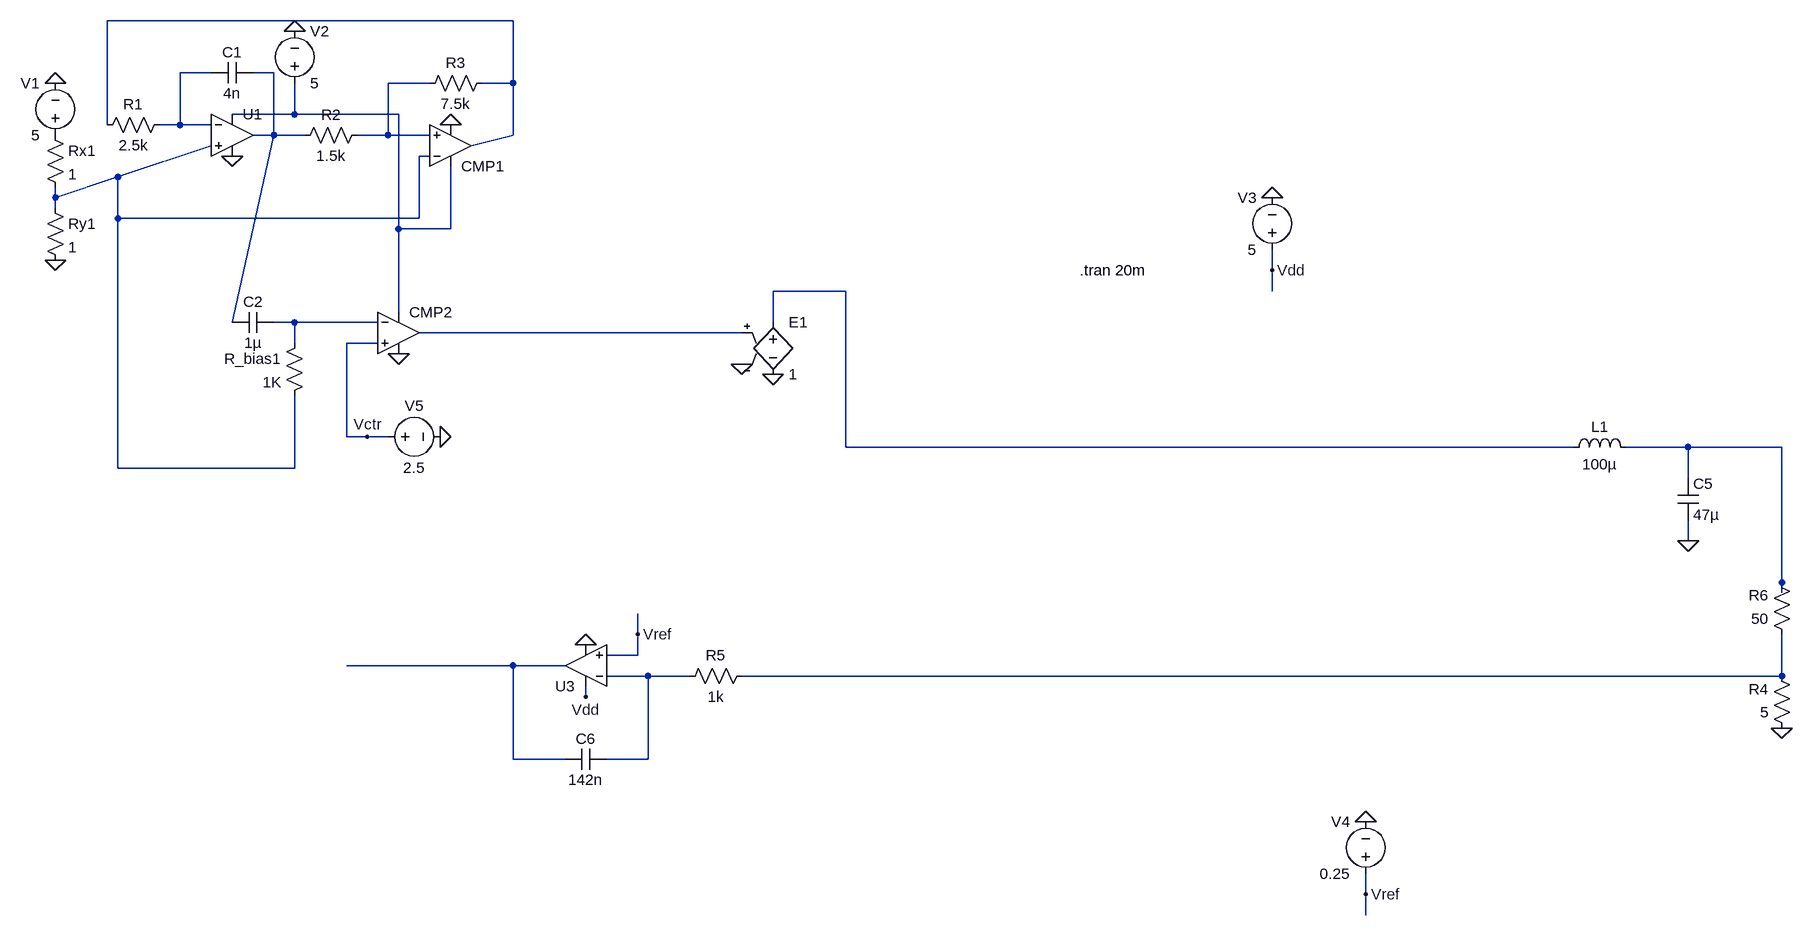
[diagram p0: schematic Module_3 copy.asc]
Module_3 copy.asc, the LTspice schematic file:
Version 4
SHEET 1 1484 1276
WIRE -640 -128 -1264 -128
WIRE -1104 -48 -1152 -48
WIRE -1008 -48 -1040 -48
WIRE -768 -32 -832 -32
WIRE -640 -32 -640 -128
WIRE -640 -32 -688 -32
WIRE -976 16 -976 -32
WIRE -976 16 -1072 16
WIRE -816 16 -976 16
WIRE -1264 32 -1264 -128
WIRE -1152 32 -1152 -48
WIRE -1152 32 -1184 32
WIRE -1104 32 -1152 32
WIRE -1008 48 -1008 -48
WIRE -1008 48 -1040 48
WIRE -960 48 -1008 48
WIRE -832 48 -832 -32
WIRE -832 48 -880 48
WIRE -768 48 -832 48
WIRE -640 48 -640 -32
WIRE -704 64 -640 48
WIRE -768 80 -784 80
WIRE -1248 112 -1104 64
WIRE -1344 144 -1248 112
WIRE -1344 144 -1344 128
WIRE -1344 160 -1344 144
WIRE -1248 176 -1248 112
WIRE -784 176 -784 80
WIRE -784 176 -1248 176
WIRE -816 192 -816 16
WIRE -736 192 -736 96
WIRE -736 192 -816 192
WIRE 528 256 528 224
WIRE -128 288 -240 288
WIRE 528 288 528 256
WIRE -816 320 -816 192
WIRE -1072 336 -1008 48
WIRE -976 336 -1008 336
WIRE -848 336 -976 336
WIRE -240 336 -240 288
WIRE -288 352 -784 352
WIRE -976 368 -976 336
WIRE -848 368 -896 368
WIRE -896 512 -896 368
WIRE -864 512 -896 512
WIRE -832 512 -864 512
WIRE -128 528 -128 288
WIRE 992 528 -128 528
WIRE 1168 528 1072 528
WIRE 1312 528 1168 528
WIRE -1248 560 -1248 176
WIRE -976 560 -976 448
WIRE -976 560 -1248 560
WIRE 1168 576 1168 528
WIRE 1168 672 1168 640
WIRE 1312 736 1312 528
WIRE 1312 752 1312 736
WIRE -448 816 -448 784
WIRE -448 848 -448 816
WIRE -448 848 -496 848
WIRE -640 864 -896 864
WIRE -560 864 -640 864
WIRE -432 880 -496 880
WIRE -368 880 -432 880
WIRE 1312 880 1312 816
WIRE 1312 880 -288 880
WIRE -528 912 -528 896
WIRE -640 1008 -640 864
WIRE -560 1008 -640 1008
WIRE -432 1008 -432 880
WIRE -432 1008 -496 1008
WIRE 672 1216 672 1184
WIRE 672 1248 672 1216
FLAG -1344 -32 0
FLAG -1344 240 0
FLAG -976 -112 0
FLAG -1072 80 0
FLAG -816 384 0
FLAG -736 32 0
FLAG 1168 672 0
FLAG 528 144 0
FLAG 528 256 Vdd
FLAG -528 912 Vdd
FLAG 1312 960 0
FLAG -528 832 0
FLAG 672 1104 0
FLAG 672 1216 Vref
FLAG -448 816 Vref
FLAG -752 512 0
FLAG -864 512 Vctr
FLAG -288 400 0
FLAG -240 416 0
SYMBOL voltage -1344 64 R180
WINDOW 0 24 96 Left 2
WINDOW 3 24 16 Left 2
SYMATTR InstName V1
SYMATTR Value 5
SYMBOL res -1360 32 R0
SYMATTR InstName Rx1
SYMATTR Value 1
SYMBOL res -1360 144 R0
SYMATTR InstName Ry1
SYMATTR Value 1
SYMBOL res -1168 16 R90
WINDOW 0 0 56 VBottom 2
WINDOW 3 32 56 VTop 2
SYMATTR InstName R1
SYMATTR Value 2.5k
SYMBOL res -864 32 R90
WINDOW 0 0 56 VBottom 2
WINDOW 3 32 56 VTop 2
SYMATTR InstName R2
SYMATTR Value 1.5k
SYMBOL res -672 -48 R90
WINDOW 0 0 56 VBottom 2
WINDOW 3 32 56 VTop 2
SYMATTR InstName R3
SYMATTR Value 7.5k
SYMBOL cap -1104 -32 R270
WINDOW 0 32 32 VTop 2
WINDOW 3 0 32 VBottom 2
SYMATTR InstName C1
SYMATTR Value 4n
SYMBOL cap -1008 320 R90
WINDOW 0 0 32 VBottom 2
WINDOW 3 32 32 VTop 2
SYMATTR InstName C2
SYMATTR Value 1µ
SYMBOL voltage -976 -16 M180
WINDOW 0 24 96 Left 2
WINDOW 3 24 16 Left 2
SYMATTR InstName V2
SYMATTR Value 5
SYMBOL res -960 352 M0
SYMATTR InstName R_bias1
SYMATTR Value 1K
SYMBOL UniversalOpamp2 -736 64 M180
SYMATTR InstName CMP1
SYMBOL UniversalOpamp2 -816 352 R0
SYMATTR InstName CMP2
SYMBOL UniversalOpamp2 -1072 48 R0
SYMATTR InstName U1
SYMBOL cap 1152 576 R0
SYMATTR InstName C5
SYMATTR Value 47µ
SYMBOL ind 976 544 R270
WINDOW 0 32 56 VTop 2
WINDOW 3 5 56 VBottom 2
SYMATTR InstName L1
SYMATTR Value 100µ
SYMBOL voltage 528 240 R180
WINDOW 0 24 96 Left 2
WINDOW 3 24 16 Left 2
SYMATTR InstName V3
SYMATTR Value 5
SYMBOL UniversalOpamp2 -528 864 R180
SYMATTR InstName U3
SYMBOL res -272 864 R90
WINDOW 0 0 56 VBottom 2
WINDOW 3 32 56 VTop 2
SYMATTR InstName R5
SYMATTR Value 1k
SYMBOL cap -496 992 R90
WINDOW 0 0 32 VBottom 2
WINDOW 3 32 32 VTop 2
SYMATTR InstName C6
SYMATTR Value 142n
SYMBOL res 1328 976 R180
WINDOW 0 36 76 Left 2
WINDOW 3 36 40 Left 2
SYMATTR InstName R4
SYMATTR Value 5
SYMBOL voltage 672 1200 R180
WINDOW 0 24 96 Left 2
WINDOW 3 24 16 Left 2
SYMATTR InstName V4
SYMATTR Value 0.25
SYMBOL res 1328 832 R180
WINDOW 0 36 76 Left 2
WINDOW 3 36 40 Left 2
SYMATTR InstName R6
SYMATTR Value 50
SYMBOL voltage -848 512 R270
WINDOW 0 32 56 VTop 2
WINDOW 3 -32 56 VBottom 2
SYMATTR InstName V5
SYMATTR Value 2.5
SYMBOL e -240 320 R0
SYMATTR InstName E1
SYMATTR Value 1
TEXT 232 256 Left 2 !.tran 20m

The netlist it stands for:
* Module_3 copy.asc
V1 P001 0 5
Rx1 P001 N006 1
Ry1 N006 0 1
R1 N002 N001 2.5k
R2 N004 N003 1.5k
R3 N001 N004 7.5k
C1 N002 N003 4n
C2 N008 N003 1µ
V2 N005 0 5
R_bias1 N008 N006 1K
XCMP1 N004 N006 N005 0 N001 level.2 Avol=1Meg GBW=10Meg Slew=10Meg ilimit=25m rail=0 Vos=0 phimargin=45 en=0 enk=0 in=0 ink=0 Rin=500Meg  ; pins IN+ IN- V+ V- OUT
XCMP2 Vctr N008 N005 0 N009 level.2 Avol=1Meg GBW=10Meg Slew=10Meg ilimit=25m rail=0 Vos=0 phimargin=45 en=0 enk=0 in=0 ink=0 Rin=500Meg  ; pins IN+ IN- V+ V- OUT
XU1 N006 N002 N005 0 N003 level.2 Avol=1Meg GBW=10Meg Slew=10Meg ilimit=25m rail=0 Vos=0 phimargin=45 en=0 enk=0 in=0 ink=0 Rin=500Meg  ; pins IN+ IN- V+ V- OUT
C5 N010 0 47µ
L1 N007 N010 100µ
V3 Vdd 0 5
XU3 Vref N012 Vdd 0 N011 level.2 Avol=1Meg GBW=10Meg Slew=10Meg ilimit=25m rail=0 Vos=0 phimargin=45 en=0 enk=0 in=0 ink=0 Rin=500Meg  ; pins IN+ IN- V+ V- OUT
R5 N013 N012 1k
C6 N012 N011 142n
R4 0 N013 5
V4 Vref 0 0.25
R6 N013 N010 50
V5 Vctr 0 2.5
E1 N007 0 N009 0 1
.tran 20m
.lib UniversalOpamps2.sub
.backanno
.end